# EAGLE schematic posidmux (EAGLE 6.6.0)

## Sheet 1 of 3
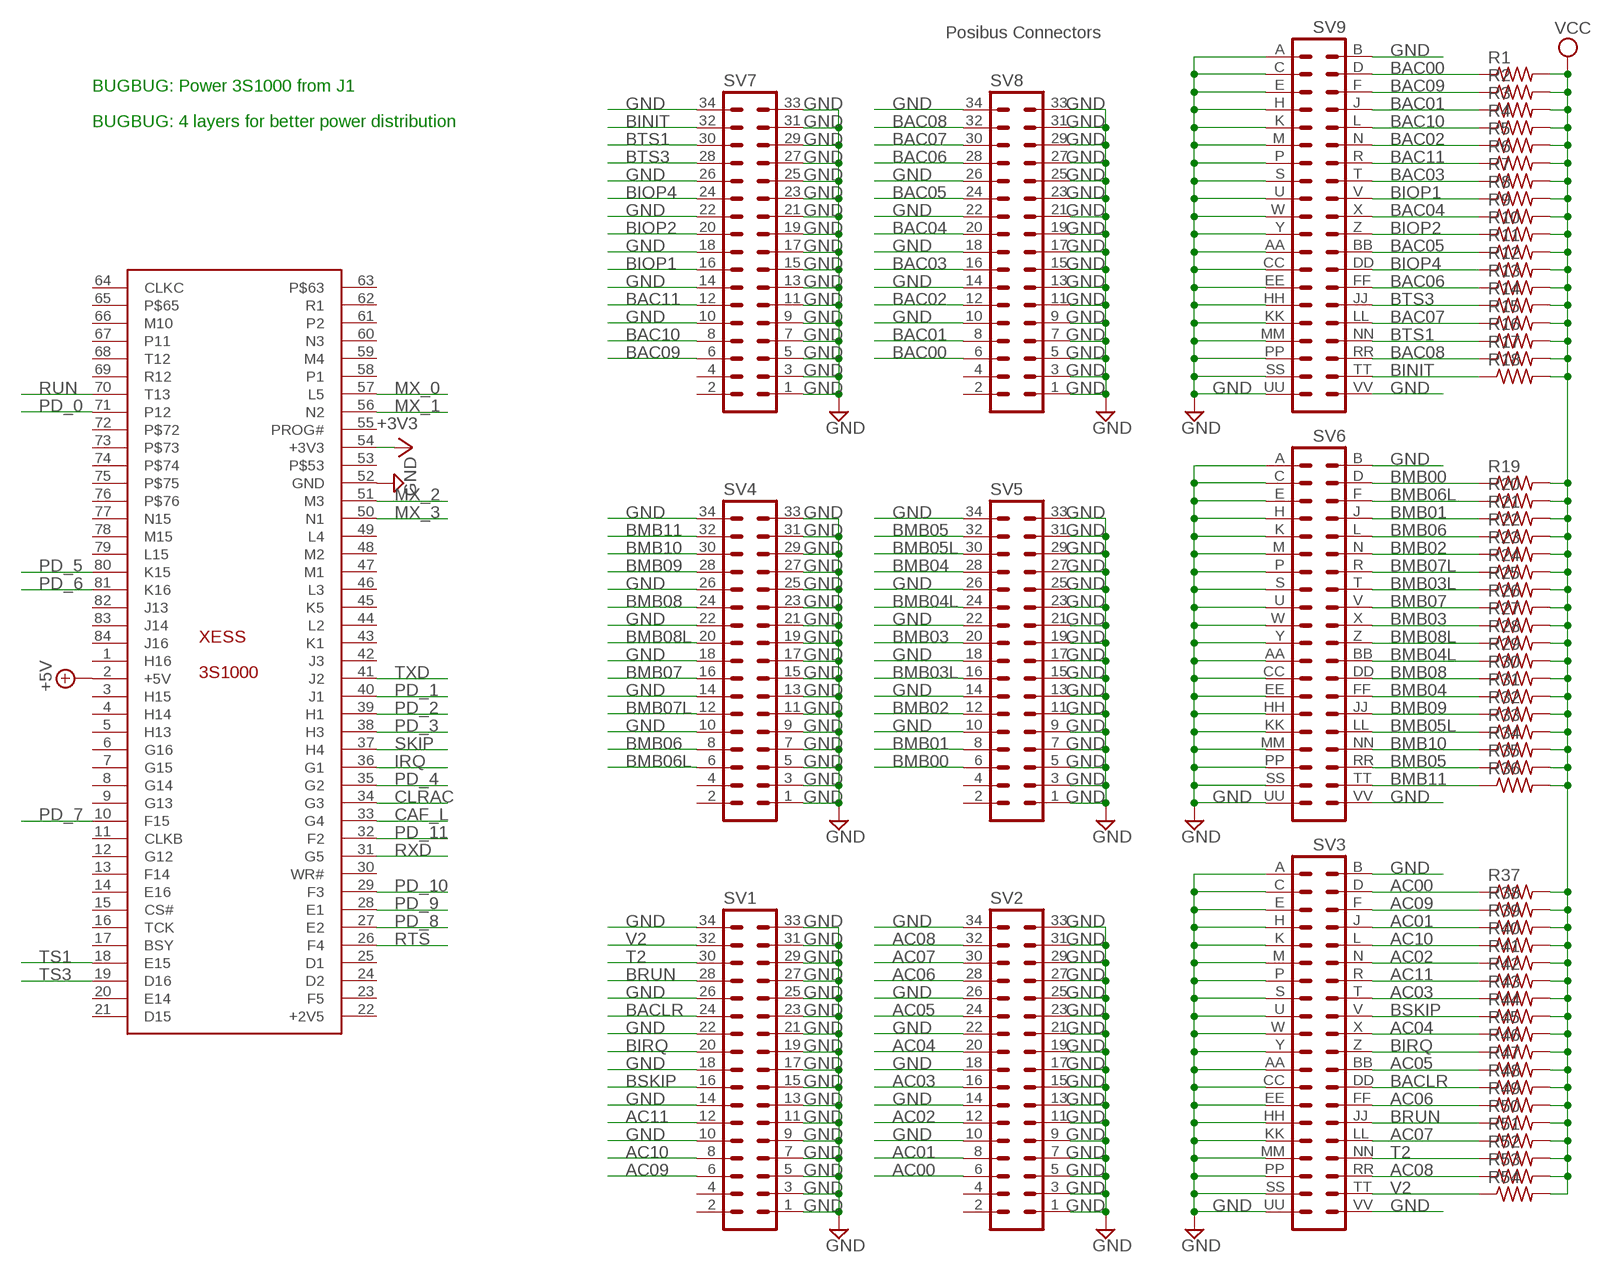
[diagram p0: schematic, sheet 1]

### Parts
R1  R-US_0207/10  [0207/10]
R2  R-US_0207/10  [0207/10]
R3  R-US_0207/10  [0207/10]
R4  R-US_0207/10  [0207/10]
R5  R-US_0207/10  [0207/10]
R6  R-US_0207/10  [0207/10]
R7  R-US_0207/10  [0207/10]
R8  R-US_0207/10  [0207/10]
R9  R-US_0207/10  [0207/10]
R10  R-US_0207/10  [0207/10]
R11  R-US_0207/10  [0207/10]
R12  R-US_0207/10  [0207/10]
R13  R-US_0207/10  [0207/10]
R14  R-US_0207/10  [0207/10]
R15  R-US_0207/10  [0207/10]
R16  R-US_0207/10  [0207/10]
R17  R-US_0207/10  [0207/10]
R18  R-US_0207/10  [0207/10]
R19  R-US_0207/10  [0207/10]
R20  R-US_0207/10  [0207/10]
R21  R-US_0207/10  [0207/10]
R22  R-US_0207/10  [0207/10]
R23  R-US_0207/10  [0207/10]
R24  R-US_0207/10  [0207/10]
R25  R-US_0207/10  [0207/10]
R26  R-US_0207/10  [0207/10]
R27  R-US_0207/10  [0207/10]
R28  R-US_0207/10  [0207/10]
R29  R-US_0207/10  [0207/10]
R30  R-US_0207/10  [0207/10]
R31  R-US_0207/10  [0207/10]
R32  R-US_0207/10  [0207/10]
R33  R-US_0207/10  [0207/10]
R34  R-US_0207/10  [0207/10]
R35  R-US_0207/10  [0207/10]
R36  R-US_0207/10  [0207/10]
R37  R-US_0207/10  [0207/10]
R38  R-US_0207/10  [0207/10]
R39  R-US_0207/10  [0207/10]
R40  R-US_0207/10  [0207/10]
R41  R-US_0207/10  [0207/10]
R42  R-US_0207/10  [0207/10]
R43  R-US_0207/10  [0207/10]
R44  R-US_0207/10  [0207/10]
R45  R-US_0207/10  [0207/10]
R46  R-US_0207/10  [0207/10]
R47  R-US_0207/10  [0207/10]
R48  R-US_0207/10  [0207/10]
R49  R-US_0207/10  [0207/10]
R50  R-US_0207/10  [0207/10]
R51  R-US_0207/10  [0207/10]
R52  R-US_0207/10  [0207/10]
R53  R-US_0207/10  [0207/10]
R54  R-US_0207/10  [0207/10]
SV1  MA17-2  [MA17-2]
SV2  MA17-2  [MA17-2]
SV3  DEC40PINV  [DEC40PINV]
SV4  MA17-2  [MA17-2]
SV5  MA17-2  [MA17-2]
SV6  DEC40PINV  [DEC40PINV]
SV7  MA17-2  [MA17-2]
SV8  MA17-2  [MA17-2]
SV9  DEC40PINV  [DEC40PINV]
XESS  3S1000  [3S1000]

### Nets
+3V3: XESS.54(+3V3) ; also sheet 3
+5V: XESS.2(+5V)
AC00: R37.1 SV2.6 SV3.D ; also sheet 3
AC01: R39.1 SV2.8 SV3.J ; also sheet 3
AC02: R41.1 SV2.12 SV3.N ; also sheet 3
AC03: R43.1 SV2.16 SV3.T ; also sheet 3
AC04: R45.1 SV2.20 SV3.X ; also sheet 3
AC05: R47.1 SV2.24 SV3.BB ; also sheet 3
AC06: R49.1 SV2.28 SV3.FF ; also sheet 3
AC07: R51.1 SV2.30 SV3.LL ; also sheet 3
AC08: R53.1 SV2.32 SV3.RR ; also sheet 3
AC09: R38.1 SV1.6 SV3.F ; also sheet 3
AC10: R40.1 SV1.8 SV3.L ; also sheet 3
AC11: R42.1 SV1.12 SV3.R ; also sheet 3
BAC00: R1.1 SV8.6 SV9.D ; also sheet 2
BAC01: R3.1 SV8.8 SV9.J ; also sheet 2
BAC02: R5.1 SV8.12 SV9.N ; also sheet 2
BAC03: R7.1 SV8.16 SV9.T ; also sheet 2
BAC04: R9.1 SV8.20 SV9.X ; also sheet 2
BAC05: R11.1 SV8.24 SV9.BB ; also sheet 2
BAC06: R13.1 SV8.28 SV9.FF ; also sheet 2
BAC07: R15.1 SV8.30 SV9.LL ; also sheet 2
BAC08: R17.1 SV8.32 SV9.RR ; also sheet 2
BAC09: R2.1 SV7.6 SV9.F ; also sheet 2
BAC10: R4.1 SV7.8 SV9.L ; also sheet 2
BAC11: R6.1 SV7.12 SV9.R ; also sheet 2
BACLR: R48.1 SV1.24 SV3.DD ; also sheet 3
BINIT: R18.1 SV7.32 SV9.TT ; also sheet 3
BIOP1: R8.1 SV7.16 SV9.V ; also sheet 3
BIOP2: R10.1 SV7.20 SV9.Z ; also sheet 3
BIOP4: R12.1 SV7.24 SV9.DD ; also sheet 3
BIRQ: R46.1 SV1.20 SV3.Z ; also sheet 3
BMB00: R19.1 SV5.6 SV6.D ; also sheet 2
BMB01: R21.1 SV5.8 SV6.J ; also sheet 2
BMB02: R23.1 SV5.12 SV6.N ; also sheet 2
BMB03: R27.1 SV5.20 SV6.X ; also sheet 2
BMB03L: R25.1 SV5.16 SV6.T ; also sheet 2
BMB04: R31.1 SV5.28 SV6.FF ; also sheet 2
BMB04L: R29.1 SV5.24 SV6.BB ; also sheet 2
BMB05: R35.1 SV5.32 SV6.RR ; also sheet 2
BMB05L: R33.1 SV5.30 SV6.LL ; also sheet 2
BMB06: R22.1 SV4.8 SV6.L ; also sheet 2
BMB06L: R20.1 SV4.6 SV6.F ; also sheet 2
BMB07: R26.1 SV4.16 SV6.V ; also sheet 2
BMB07L: R24.1 SV4.12 SV6.R ; also sheet 2
BMB08: R30.1 SV4.24 SV6.DD ; also sheet 2
BMB08L: R28.1 SV4.20 SV6.Z ; also sheet 2
BMB09: R32.1 SV4.28 SV6.JJ ; also sheet 2
BMB10: R34.1 SV4.30 SV6.NN ; also sheet 2
BMB11: R36.1 SV4.32 SV6.TT ; also sheet 2
BRUN: R50.1 SV1.28 SV3.JJ ; also sheet 3
BSKIP: R44.1 SV1.16 SV3.V ; also sheet 3
BTS1: R16.1 SV7.30 SV9.NN ; also sheet 3
BTS3: R14.1 SV7.28 SV9.JJ ; also sheet 3
CAF_L: XESS.33(G4) ; also sheet 3
CLRAC: XESS.34(G3) ; also sheet 3
GND: SV1.1 SV1.3 SV1.5 SV1.7 SV1.9 SV1.10 SV1.11 SV1.13 SV1.14 SV1.15 SV1.17 SV1.18 SV1.19 SV1.21 SV1.22 SV1.23 SV1.25 SV1.26 SV1.27 SV1.29 SV1.31 SV1.33 SV1.34 SV2.1 SV2.3 SV2.5 SV2.7 SV2.9 SV2.10 SV2.11 SV2.13 SV2.14 SV2.15 SV2.17 SV2.18 SV2.19 SV2.21 SV2.22 SV2.23 SV2.25 SV2.26 SV2.27 SV2.29 SV2.31 SV2.33 SV2.34 SV3.A SV3.AA SV3.B SV3.C SV3.CC SV3.E SV3.EE SV3.H SV3.HH SV3.K SV3.KK SV3.M SV3.MM SV3.P SV3.PP SV3.S SV3.SS SV3.U SV3.UU SV3.VV SV3.W SV3.Y SV4.1 SV4.3 SV4.5 SV4.7 SV4.9 SV4.10 SV4.11 SV4.13 SV4.14 SV4.15 SV4.17 SV4.18 SV4.19 SV4.21 SV4.22 SV4.23 SV4.25 SV4.26 SV4.27 SV4.29 SV4.31 SV4.33 SV4.34 SV5.1 SV5.3 SV5.5 SV5.7 SV5.9 SV5.10 SV5.11 SV5.13 SV5.14 SV5.15 SV5.17 SV5.18 SV5.19 SV5.21 SV5.22 SV5.23 SV5.25 SV5.26 SV5.27 SV5.29 SV5.31 SV5.33 SV5.34 SV6.A SV6.AA SV6.B SV6.C SV6.CC SV6.E SV6.EE SV6.H SV6.HH SV6.K SV6.KK SV6.M SV6.MM SV6.P SV6.PP SV6.S SV6.SS SV6.U SV6.UU SV6.VV SV6.W SV6.Y SV7.1 SV7.3 SV7.5 SV7.7 SV7.9 SV7.10 SV7.11 SV7.13 SV7.14 SV7.15 SV7.17 SV7.18 SV7.19 SV7.21 SV7.22 SV7.23 SV7.25 SV7.26 SV7.27 SV7.29 SV7.31 SV7.33 SV7.34 SV8.1 SV8.3 SV8.5 SV8.7 SV8.9 SV8.10 SV8.11 SV8.13 SV8.14 SV8.15 SV8.17 SV8.18 SV8.19 SV8.21 SV8.22 SV8.23 SV8.25 SV8.26 SV8.27 SV8.29 SV8.31 SV8.33 SV8.34 SV9.A SV9.AA SV9.B SV9.C SV9.CC SV9.E SV9.EE SV9.H SV9.HH SV9.K SV9.KK SV9.M SV9.MM SV9.P SV9.PP SV9.S SV9.SS SV9.U SV9.UU SV9.VV SV9.W SV9.Y XESS.52(GND) ; also sheet 2,3
IRQ: XESS.36(G1) ; also sheet 3
MX_0: XESS.57(L5) ; also sheet 2
MX_1: XESS.56(N2) ; also sheet 2
MX_2: XESS.51(M3) ; also sheet 2
MX_3: XESS.50(N1) ; also sheet 2
PD_0: XESS.71(P12) ; also sheet 2,3
PD_1: XESS.40(J1) ; also sheet 2,3
PD_2: XESS.39(H1) ; also sheet 2,3
PD_3: XESS.38(H3) ; also sheet 2,3
PD_4: XESS.35(G2) ; also sheet 2,3
PD_5: XESS.80(K15) ; also sheet 2,3
PD_6: XESS.81(K16) ; also sheet 2,3
PD_7: XESS.10(F15) ; also sheet 2,3
PD_8: XESS.27(E2) ; also sheet 2,3
PD_9: XESS.28(E1) ; also sheet 2,3
PD_10: XESS.29(F3) ; also sheet 2,3
PD_11: XESS.32(F2) ; also sheet 2,3
RTS: XESS.26(F4) ; also sheet 3
RUN: XESS.70(T13) ; also sheet 3
RXD: XESS.31(G5) ; also sheet 3
SKIP: XESS.37(H4) ; also sheet 3
T2: R52.1 SV1.30 SV3.NN
TS1: XESS.18(E15) ; also sheet 3
TS3: XESS.19(D16) ; also sheet 3
TXD: XESS.41(J2) ; also sheet 3
V2: R54.1 SV1.32 SV3.TT
VCC: R1.2 R2.2 R3.2 R4.2 R5.2 R6.2 R7.2 R8.2 R9.2 R10.2 R11.2 R12.2 R13.2 R14.2 R15.2 R16.2 R17.2 R18.2 R19.2 R20.2 R21.2 R22.2 R23.2 R24.2 R25.2 R26.2 R27.2 R28.2 R29.2 R30.2 R31.2 R32.2 R33.2 R34.2 R35.2 R36.2 R37.2 R38.2 R39.2 R40.2 R41.2 R42.2 R43.2 R44.2 R45.2 R46.2 R47.2 R48.2 R49.2 R50.2 R51.2 R52.2 R53.2 R54.2 ; also sheet 2,3
Unconnected: SV1.2 SV1.4 SV2.2 SV2.4 SV4.2 SV4.4 SV5.2 SV5.4 SV7.2 SV7.4 SV8.2 SV8.4 XESS.1(H16) XESS.3(H15) XESS.4(H14) XESS.5(H13) XESS.6(G16) XESS.7(G15) XESS.8(G14) XESS.9(G13) XESS.11(CLKB) XESS.12(G12) XESS.13(F14) XESS.14(E16) XESS.15(CS#) XESS.16(TCK) XESS.17(BSY) XESS.20(E14) XESS.21(D15) XESS.23(F5) XESS.24(D2) XESS.25(D1) XESS.30(WR#) XESS.42(J3) XESS.43(K1) XESS.44(L2) XESS.45(K5) XESS.46(L3) XESS.47(M1) XESS.48(M2) XESS.49(L4) XESS.53 XESS.55(PROG#) XESS.58(P1) XESS.59(M4) XESS.60(N3) XESS.61(P2) XESS.62(R1) XESS.63 XESS.64(CLKC) XESS.65 XESS.66(M10) XESS.67(P11) XESS.68(T12) XESS.69(R12) XESS.72 XESS.73 XESS.74 XESS.75 XESS.76 XESS.77(N15) XESS.78(M15) XESS.79(L15) XESS.82(J13) XESS.83(J14) XESS.84(J16)

### Notes on the sheet
- Posibus Connectors
- BUGBUG: Power 3S1000 from J1
- BUGBUG: 4 layers for better power distribution

## Sheet 2 of 3
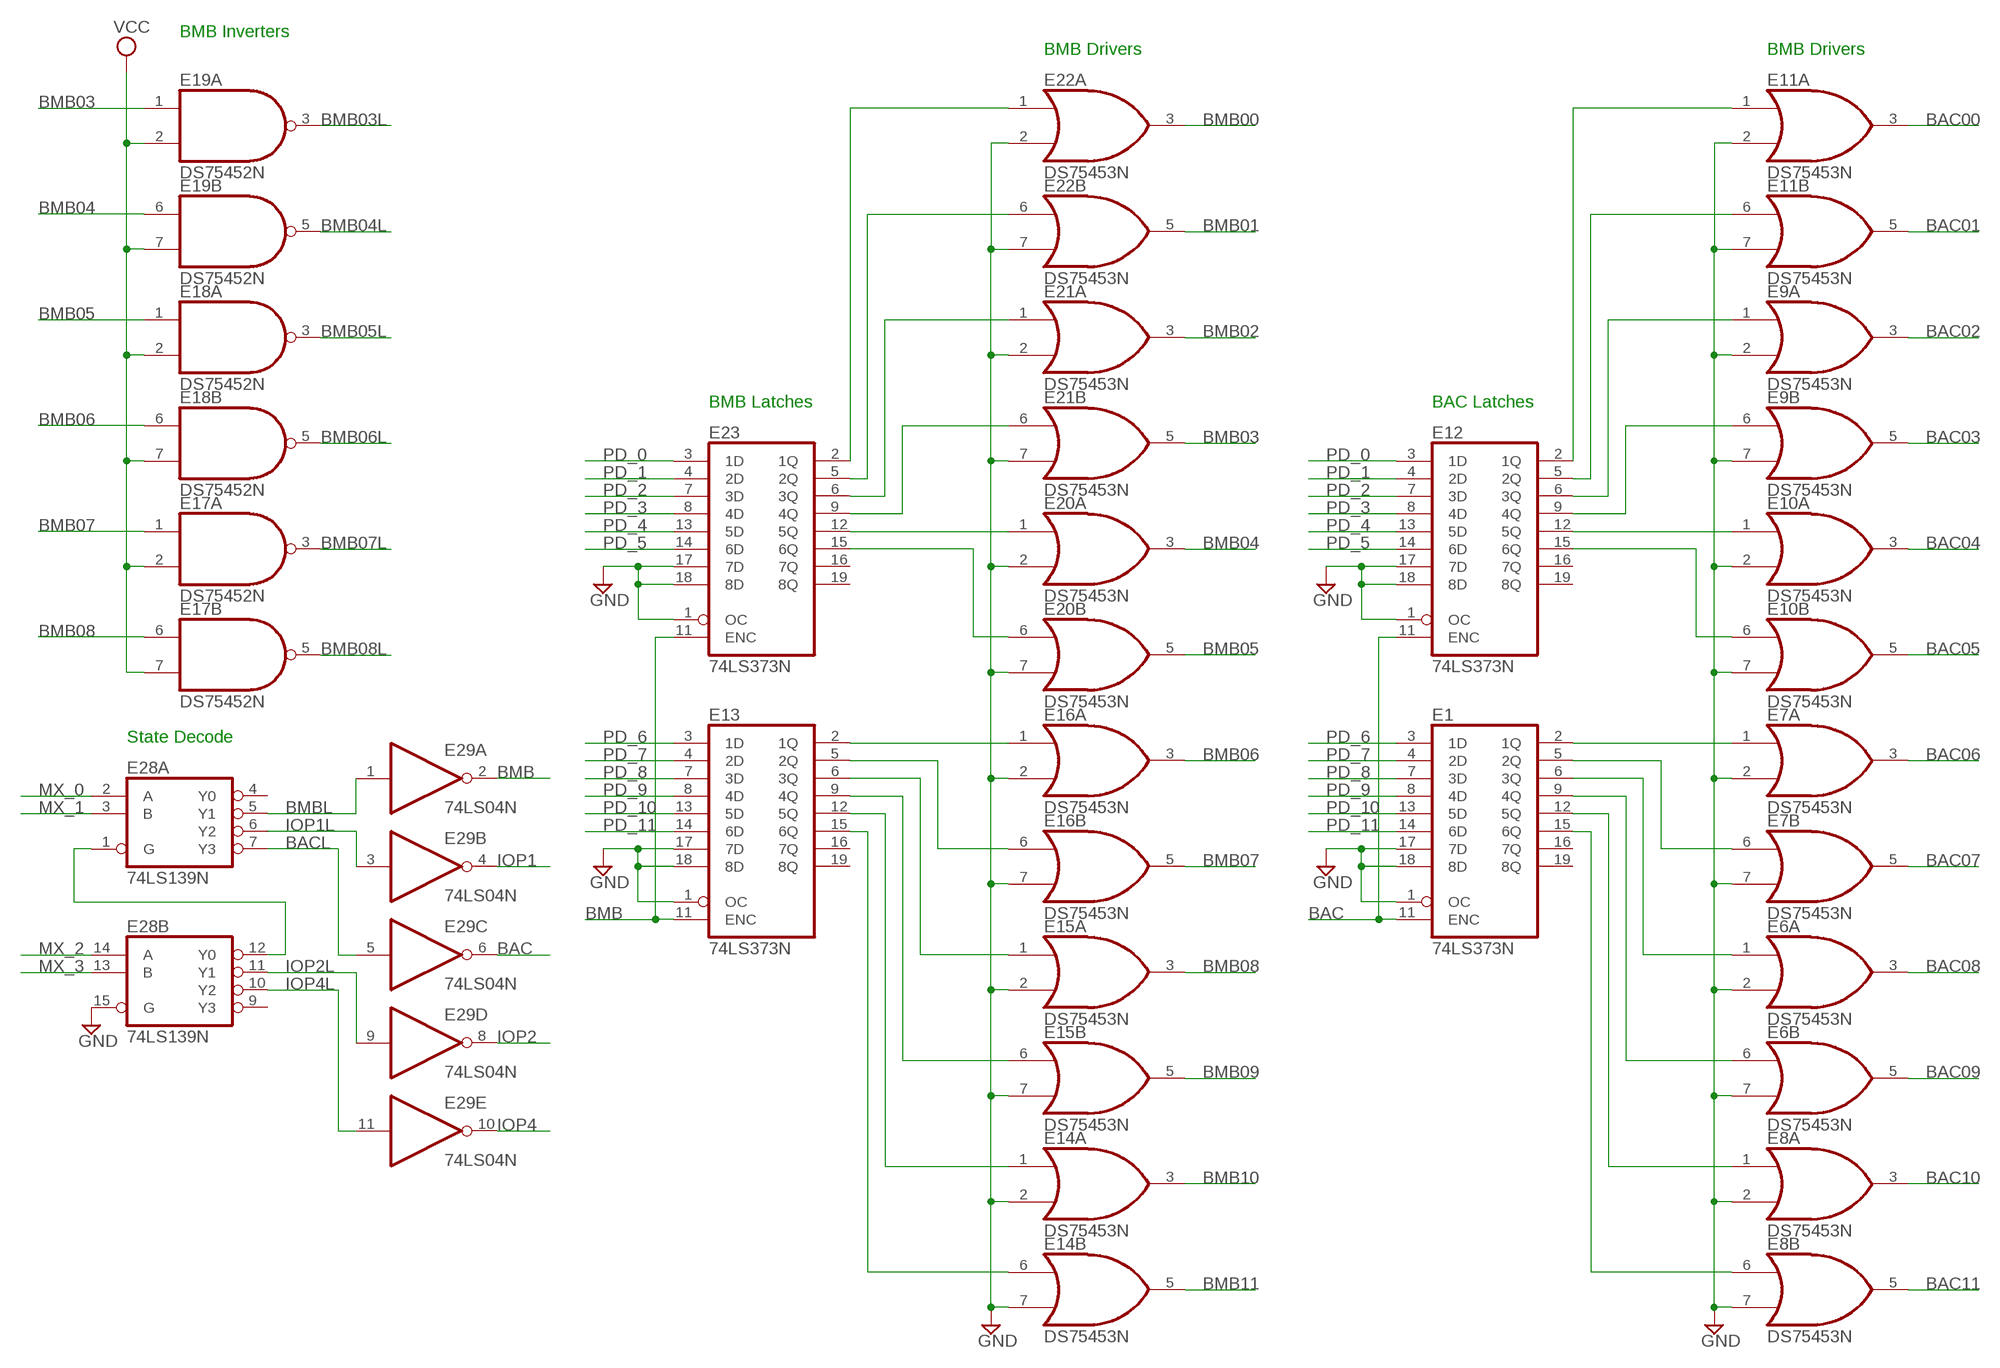
[diagram p1: schematic, sheet 2]

### Parts
E1  74LS373N  [DIL20]
E6  DS75453N  [DIL08]
E7  DS75453N  [DIL08]
E8  DS75453N  [DIL08]
E9  DS75453N  [DIL08]
E10  DS75453N  [DIL08]
E11  DS75453N  [DIL08]
E12  74LS373N  [DIL20]
E13  74LS373N  [DIL20]
E14  DS75453N  [DIL08]
E15  DS75453N  [DIL08]
E16  DS75453N  [DIL08]
E17  DS75452N  [DIL08]
E18  DS75452N  [DIL08]
E19  DS75452N  [DIL08]
E20  DS75453N  [DIL08]
E21  DS75453N  [DIL08]
E22  DS75453N  [DIL08]
E23  74LS373N  [DIL20]
E28  74LS139N  [DIL16]
E29  74LS04N  [DIL14]

### Nets
BAC: E1.11(ENC) E12.11(ENC) E29.6(C:O)
BAC00: E11.3(A:O) ; also sheet 1
BAC01: E11.5(B:O) ; also sheet 1
BAC02: E9.3(A:O) ; also sheet 1
BAC03: E9.5(B:O) ; also sheet 1
BAC04: E10.3(A:O) ; also sheet 1
BAC05: E10.5(B:O) ; also sheet 1
BAC06: E7.3(A:O) ; also sheet 1
BAC07: E7.5(B:O) ; also sheet 1
BAC08: E6.3(A:O) ; also sheet 1
BAC09: E6.5(B:O) ; also sheet 1
BAC10: E8.3(A:O) ; also sheet 1
BAC11: E8.5(B:O) ; also sheet 1
BACL: E28.7(A:Y3) E29.5(C:I)
BMB: E13.11(ENC) E23.11(ENC) E29.2(A:O)
BMB00: E22.3(A:O) ; also sheet 1
BMB01: E22.5(B:O) ; also sheet 1
BMB02: E21.3(A:O) ; also sheet 1
BMB03: E19.1(A:I0) E21.5(B:O) ; also sheet 1
BMB03L: E19.3(A:O) ; also sheet 1
BMB04: E19.6(B:I0) E20.3(A:O) ; also sheet 1
BMB04L: E19.5(B:O) ; also sheet 1
BMB05: E18.1(A:I0) E20.5(B:O) ; also sheet 1
BMB05L: E18.3(A:O) ; also sheet 1
BMB06: E16.3(A:O) E18.6(B:I0) ; also sheet 1
BMB06L: E18.5(B:O) ; also sheet 1
BMB07: E16.5(B:O) E17.1(A:I0) ; also sheet 1
BMB07L: E17.3(A:O) ; also sheet 1
BMB08: E15.3(A:O) E17.6(B:I0) ; also sheet 1
BMB08L: E17.5(B:O) ; also sheet 1
BMB09: E15.5(B:O) ; also sheet 1
BMB10: E14.3(A:O) ; also sheet 1
BMB11: E14.5(B:O) ; also sheet 1
BMBL: E28.5(A:Y1) E29.1(A:I)
GND: E1.1(OC) E1.17(7D) E1.18(8D) E6.2(A:I1) E6.7(B:I1) E7.2(A:I1) E7.7(B:I1) E8.2(A:I1) E8.7(B:I1) E9.2(A:I1) E9.7(B:I1) E10.2(A:I1) E10.7(B:I1) E11.2(A:I1) E11.7(B:I1) E12.1(OC) E12.17(7D) E12.18(8D) E13.1(OC) E13.17(7D) E13.18(8D) E14.2(A:I1) E14.7(B:I1) E15.2(A:I1) E15.7(B:I1) E16.2(A:I1) E16.7(B:I1) E20.2(A:I1) E20.7(B:I1) E21.2(A:I1) E21.7(B:I1) E22.2(A:I1) E22.7(B:I1) E23.1(OC) E23.17(7D) E23.18(8D) E28.15(B:G) ; also sheet 1,3
IOP1: E29.4(B:O) ; also sheet 3
IOP1L: E28.6(A:Y2) E29.3(B:I) ; also sheet 3
IOP2: E29.8(D:O) ; also sheet 3
IOP2L: E28.11(B:Y1) E29.9(D:I) ; also sheet 3
IOP4: E29.10(E:O) ; also sheet 3
IOP4L: E28.10(B:Y2) E29.11(E:I) ; also sheet 3
MX_0: E28.2(A:A) ; also sheet 1
MX_00XX: E28.1(A:G) E28.12(B:Y0)
MX_1: E28.3(A:B) ; also sheet 1
MX_2: E28.14(B:A) ; also sheet 1
MX_3: E28.13(B:B) ; also sheet 1
N$1: E22.1(A:I0) E23.2(1Q)
N$2: E22.6(B:I0) E23.5(2Q)
N$3: E21.1(A:I0) E23.6(3Q)
N$4: E21.6(B:I0) E23.9(4Q)
N$5: E20.1(A:I0) E23.12(5Q)
N$6: E13.15(6Q) E14.6(B:I0)
N$7: E13.12(5Q) E14.1(A:I0)
N$8: E13.9(4Q) E15.6(B:I0)
N$9: E13.6(3Q) E15.1(A:I0)
N$10: E13.5(2Q) E16.6(B:I0)
N$11: E13.2(1Q) E16.1(A:I0)
N$12: E20.6(B:I0) E23.15(6Q)
N$13: E11.1(A:I0) E12.2(1Q)
N$14: E11.6(B:I0) E12.5(2Q)
N$21: E9.1(A:I0) E12.6(3Q)
N$22: E9.6(B:I0) E12.9(4Q)
N$23: E10.1(A:I0) E12.12(5Q)
N$24: E1.15(6Q) E8.6(B:I0)
N$25: E1.12(5Q) E8.1(A:I0)
N$26: E1.9(4Q) E6.6(B:I0)
N$27: E1.6(3Q) E6.1(A:I0)
N$28: E1.5(2Q) E7.6(B:I0)
N$29: E10.6(B:I0) E12.15(6Q)
N$30: E1.2(1Q) E7.1(A:I0)
PD_0: E12.3(1D) E23.3(1D) ; also sheet 1,3
PD_1: E12.4(2D) E23.4(2D) ; also sheet 1,3
PD_2: E12.7(3D) E23.7(3D) ; also sheet 1,3
PD_3: E12.8(4D) E23.8(4D) ; also sheet 1,3
PD_4: E12.13(5D) E23.13(5D) ; also sheet 1,3
PD_5: E12.14(6D) E23.14(6D) ; also sheet 1,3
PD_6: E1.3(1D) E13.3(1D) ; also sheet 1,3
PD_7: E1.4(2D) E13.4(2D) ; also sheet 1,3
PD_8: E1.7(3D) E13.7(3D) ; also sheet 1,3
PD_9: E1.8(4D) E13.8(4D) ; also sheet 1,3
PD_10: E1.13(5D) E13.13(5D) ; also sheet 1,3
PD_11: E1.14(6D) E13.14(6D) ; also sheet 1,3
VCC: E17.2(A:I1) E17.7(B:I1) E18.2(A:I1) E18.7(B:I1) E19.2(A:I1) E19.7(B:I1) ; also sheet 1,3
Unconnected: E1.16(7Q) E1.19(8Q) E12.16(7Q) E12.19(8Q) E13.16(7Q) E13.19(8Q) E23.16(7Q) E23.19(8Q) E28.4(A:Y0) E28.9(B:Y3) E29.12(F:O) E29.13(F:I)

### Notes on the sheet
- BMB Inverters
- BMB Drivers | BMB Drivers
- BMB Latches | BAC Latches
- State Decode

## Sheet 3 of 3
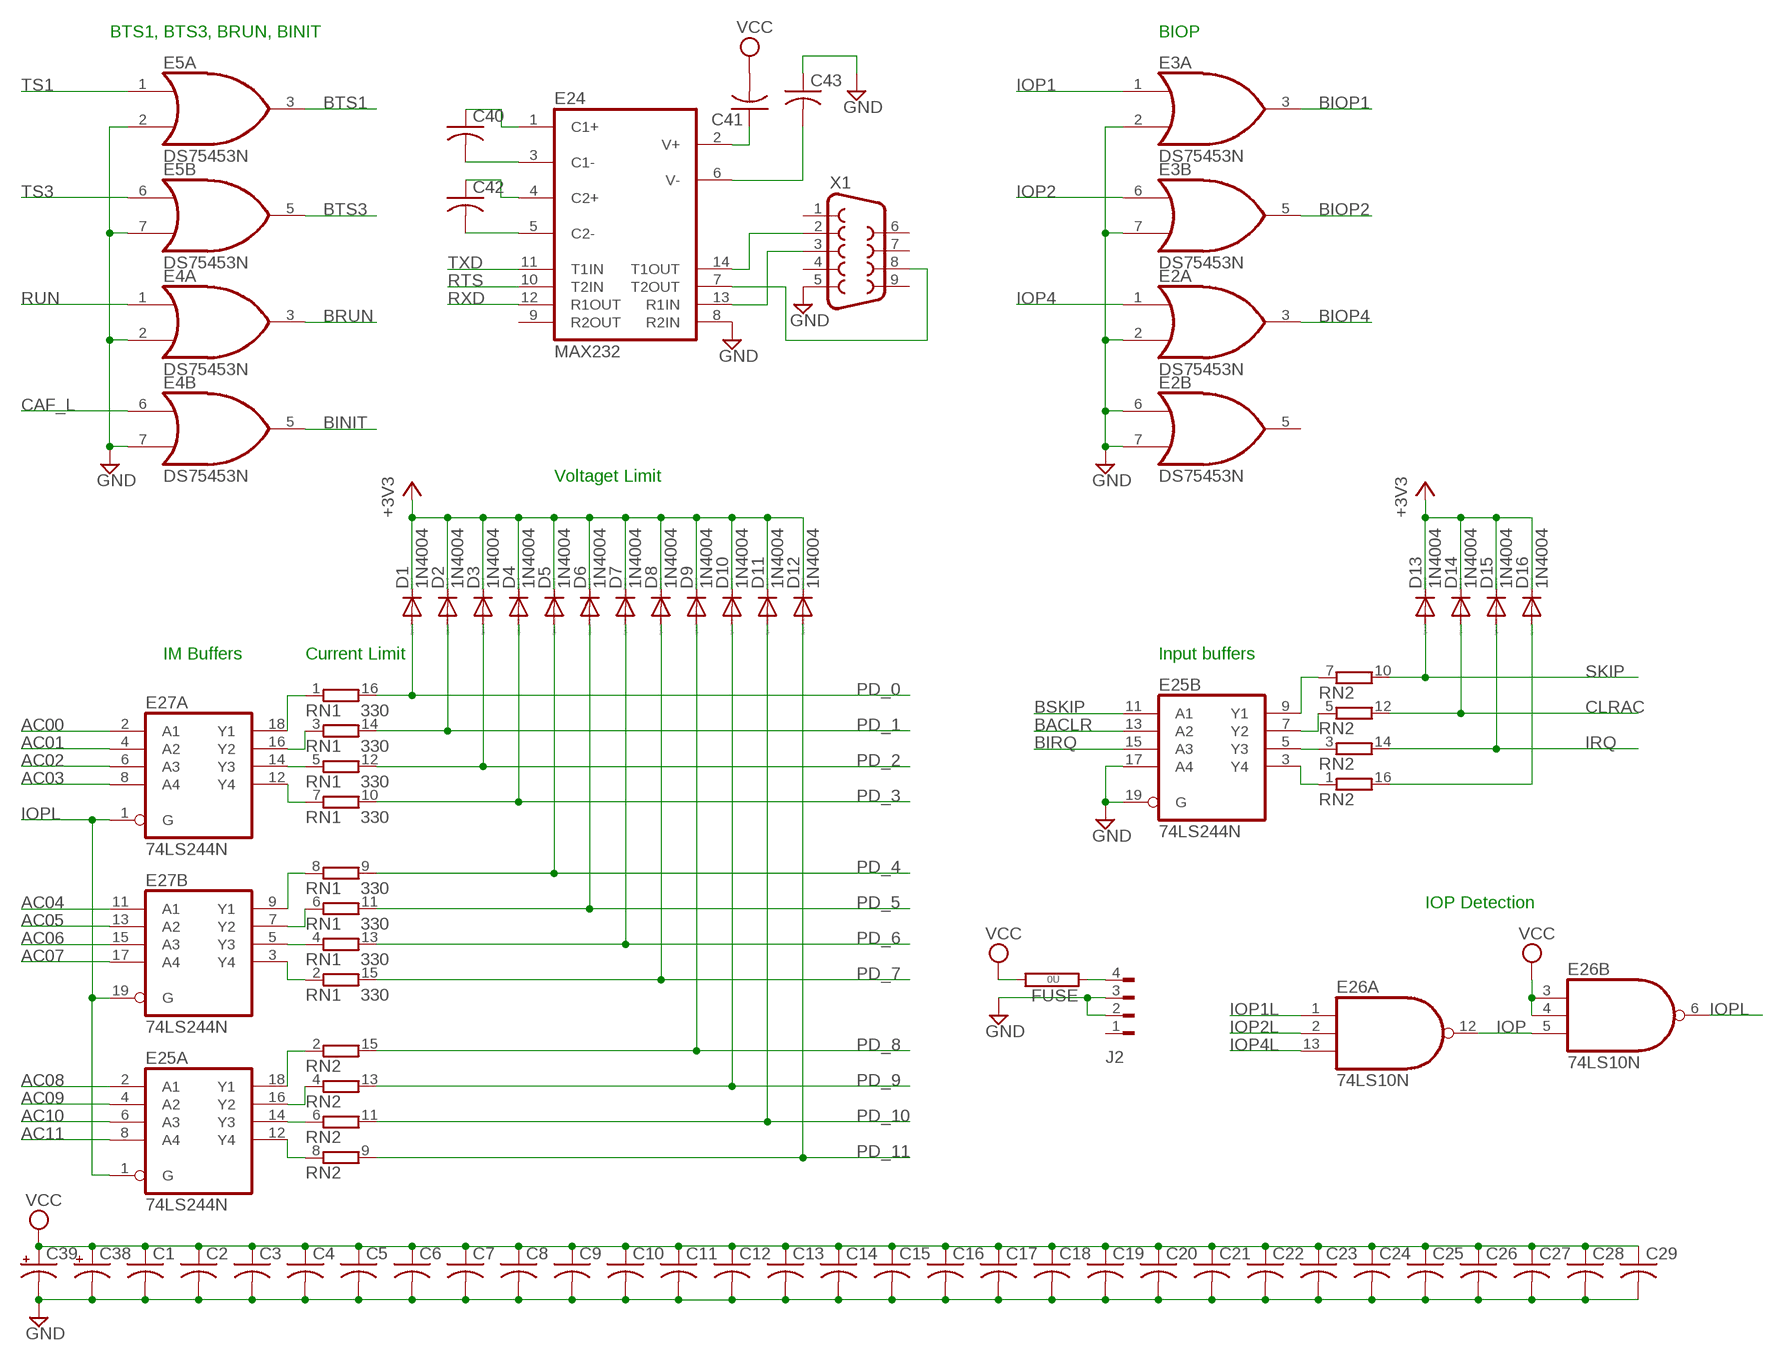
[diagram p2: schematic, sheet 3]

### Parts
C1  C-US050-025X075  [C050-025X075]
C2  C-US050-025X075  [C050-025X075]
C3  C-US050-025X075  [C050-025X075]
C4  C-US050-025X075  [C050-025X075]
C5  C-US050-025X075  [C050-025X075]
C6  C-US050-025X075  [C050-025X075]
C7  C-US050-025X075  [C050-025X075]
C8  C-US050-025X075  [C050-025X075]
C9  C-US050-025X075  [C050-025X075]
C10  C-US050-025X075  [C050-025X075]
C11  C-US050-025X075  [C050-025X075]
C12  C-US050-025X075  [C050-025X075]
C13  C-US050-025X075  [C050-025X075]
C14  C-US050-025X075  [C050-025X075]
C15  C-US050-025X075  [C050-025X075]
C16  C-US050-025X075  [C050-025X075]
C17  C-US050-025X075  [C050-025X075]
C18  C-US050-025X075  [C050-025X075]
C19  C-US050-025X075  [C050-025X075]
C20  C-US050-025X075  [C050-025X075]
C21  C-US050-025X075  [C050-025X075]
C22  C-US050-025X075  [C050-025X075]
C23  C-US050-025X075  [C050-025X075]
C24  C-US050-025X075  [C050-025X075]
C25  C-US050-025X075  [C050-025X075]
C26  C-US050-025X075  [C050-025X075]
C27  C-US050-025X075  [C050-025X075]
C28  C-US050-025X075  [C050-025X075]
C29  C-US050-025X075  [C050-025X075]
C38  CPOL-USE22-6AXIAL  [E22-6]
C39  CPOL-USE22-6AXIAL  [E22-6]
C40  C-US050-025X075  [C050-025X075]
C41  C-US050-025X075  [C050-025X075]
C42  C-US050-025X075  [C050-025X075]
C43  C-US050-025X075  [C050-025X075]
D1  1N4004  [DO41-10]
D2  1N4004  [DO41-10]
D3  1N4004  [DO41-10]
D4  1N4004  [DO41-10]
D5  1N4004  [DO41-10]
D6  1N4004  [DO41-10]
D7  1N4004  [DO41-10]
D8  1N4004  [DO41-10]
D9  1N4004  [DO41-10]
D10  1N4004  [DO41-10]
D11  1N4004  [DO41-10]
D12  1N4004  [DO41-10]
D13  1N4004  [DO41-10]
D14  1N4004  [DO41-10]
D15  1N4004  [DO41-10]
D16  1N4004  [DO41-10]
E2  DS75453N  [DIL08]
E3  DS75453N  [DIL08]
E4  DS75453N  [DIL08]
E5  DS75453N  [DIL08]
E24  MAX232  [DIL16]
E25  74LS244N  [DIL20]
E26  74LS10N  [DIL14]
E27  74LS244N  [DIL20]
FUSE  0R  [0R/10]
J2  FLOPPY-4  [FLOPPY-4]
RN1  330  8R-P  [DIL16]
RN2  8R-P  [DIL16]
X1  F09HP  [F09HP]

### Nets
+3V3: D1.C D2.C D3.C D4.C D5.C D6.C D7.C D8.C D9.C D10.C D11.C D12.C D13.C D14.C D15.C D16.C ; also sheet 1
AC00: E27.2(A:A1) ; also sheet 1
AC01: E27.4(A:A2) ; also sheet 1
AC02: E27.6(A:A3) ; also sheet 1
AC03: E27.8(A:A4) ; also sheet 1
AC04: E27.11(B:A1) ; also sheet 1
AC05: E27.13(B:A2) ; also sheet 1
AC06: E27.15(B:A3) ; also sheet 1
AC07: E27.17(B:A4) ; also sheet 1
AC08: E25.2(A:A1) ; also sheet 1
AC09: E25.4(A:A2) ; also sheet 1
AC10: E25.6(A:A3) ; also sheet 1
AC11: E25.8(A:A4) ; also sheet 1
BACLR: E25.13(B:A2) ; also sheet 1
BINIT: E4.5(B:O) ; also sheet 1
BIOP1: E3.3(A:O) ; also sheet 1
BIOP2: E3.5(B:O) ; also sheet 1
BIOP4: E2.3(A:O) ; also sheet 1
BIRQ: E25.15(B:A3) ; also sheet 1
BRUN: E4.3(A:O) ; also sheet 1
BSKIP: E25.11(B:A1) ; also sheet 1
BTS1: E5.3(A:O) ; also sheet 1
BTS3: E5.5(B:O) ; also sheet 1
CAF_L: E4.6(B:I0) ; also sheet 1
CLRAC: D14.A RN2.12 ; also sheet 1
GND: C1.2 C2.2 C3.2 C4.2 C5.2 C6.2 C7.2 C8.2 C9.2 C10.2 C11.2 C12.2 C13.2 C14.2 C15.2 C16.2 C17.2 C18.2 C19.2 C20.2 C21.2 C22.2 C23.2 C24.2 C25.2 C26.2 C27.2 C28.2 C29.2 C38.- C39.- C43.1 E2.2(A:I1) E2.6(B:I0) E2.7(B:I1) E3.2(A:I1) E3.7(B:I1) E4.2(A:I1) E4.7(B:I1) E5.2(A:I1) E5.7(B:I1) E24.8(R2IN) E25.17(B:A4) E25.19(B:G) J2.2 J2.3 X1.5 ; also sheet 1,2
IOP: E26.5(B:I2) E26.12(A:O)
IOP1: E3.1(A:I0) ; also sheet 2
IOP1L: E26.1(A:I0) ; also sheet 2
IOP2: E3.6(B:I0) ; also sheet 2
IOP2L: E26.2(A:I1) ; also sheet 2
IOP4: E2.1(A:I0) ; also sheet 2
IOP4L: E26.13(A:I2) ; also sheet 2
IOPL: E25.1(A:G) E26.6(B:O) E27.1(A:G) E27.19(B:G)
IRQ: D15.A RN2.14 ; also sheet 1
N$15: E27.18(A:Y1) RN1.1
N$16: E27.16(A:Y2) RN1.3
N$17: E27.14(A:Y3) RN1.5
N$18: E27.12(A:Y4) RN1.7
N$19: E27.9(B:Y1) RN1.8
N$20: E27.7(B:Y2) RN1.6
N$31: E27.5(B:Y3) RN1.4
N$32: E27.3(B:Y4) RN1.2
N$33: E25.16(A:Y2) RN2.4
N$34: E25.18(A:Y1) RN2.2
N$35: E25.14(A:Y3) RN2.6
N$36: E25.12(A:Y4) RN2.8
N$37: E25.9(B:Y1) RN2.7
N$38: E25.7(B:Y2) RN2.5
N$39: E25.5(B:Y3) RN2.3
N$40: E25.3(B:Y4) RN2.1
N$41 [Supply]: FUSE.1 J2.4
N$42: D16.A RN2.16
N$43: E24.14(T1OUT) X1.2
N$44: E24.7(T2OUT) X1.8
N$45: E24.13(R1IN) X1.3
N$46: C42.2 E24.5(C2-)
N$47: C42.1 E24.4(C2+)
N$48: C40.2 E24.3(C1-)
N$49: C40.1 E24.1(C1+)
N$50: C41.1 E24.2(V+)
N$51: C43.2 E24.6(V-)
PD_0: D1.A RN1.16 ; also sheet 1,2
PD_1: D2.A RN1.14 ; also sheet 1,2
PD_2: D3.A RN1.12 ; also sheet 1,2
PD_3: D4.A RN1.10 ; also sheet 1,2
PD_4: D5.A RN1.9 ; also sheet 1,2
PD_5: D6.A RN1.11 ; also sheet 1,2
PD_6: D7.A RN1.13 ; also sheet 1,2
PD_7: D8.A RN1.15 ; also sheet 1,2
PD_8: D9.A RN2.15 ; also sheet 1,2
PD_9: D10.A RN2.13 ; also sheet 1,2
PD_10: D11.A RN2.11 ; also sheet 1,2
PD_11: D12.A RN2.9 ; also sheet 1,2
RTS: E24.10(T2IN) ; also sheet 1
RUN: E4.1(A:I0) ; also sheet 1
RXD: E24.12(R1OUT) ; also sheet 1
SKIP: D13.A RN2.10 ; also sheet 1
TS1: E5.1(A:I0) ; also sheet 1
TS3: E5.6(B:I0) ; also sheet 1
TXD: E24.11(T1IN) ; also sheet 1
VCC: C1.1 C2.1 C3.1 C4.1 C5.1 C6.1 C7.1 C8.1 C9.1 C10.1 C11.1 C12.1 C13.1 C14.1 C15.1 C16.1 C17.1 C18.1 C19.1 C20.1 C21.1 C22.1 C23.1 C24.1 C25.1 C26.1 C27.1 C28.1 C29.1 C38.+ C39.+ C41.2 E26.3(B:I0) E26.4(B:I1) FUSE.2 ; also sheet 1,2
Unconnected: E2.5(B:O) E24.9(R2OUT) E26.8(C:O) E26.9(C:I0) E26.10(C:I1) E26.11(C:I2) J2.1 X1.1 X1.4 X1.6 X1.7 X1.9

### Notes on the sheet
- BTS1, BTS3, BRUN, BINIT | BIOP
- Voltaget Limit
- IM Buffers | Current Limit | Input buffers
- IOP Detection

## Power pins joined to a net without a drawn wire
+2V5: XESS.22(+2V5)
GND: E1.10(GND) E2.4(P:GND) E3.4(P:GND) E4.4(P:GND) E5.4(P:GND) E6.4(P:GND) E7.4(P:GND) E8.4(P:GND) E9.4(P:GND) E10.4(P:GND) E11.4(P:GND) E12.10(GND) E13.10(GND) E14.4(P:GND) E15.4(P:GND) E16.4(P:GND) E17.4(P:GND) E18.4(P:GND) E19.4(P:GND) E20.4(P:GND) E21.4(P:GND) E22.4(P:GND) E23.10(GND) E24.15(GND) E25.10(P:GND) E26.7(P:GND) E27.10(P:GND) E28.8(P:GND) E29.7(P:GND)
VCC: E1.20(VCC) E2.8(P:VCC) E3.8(P:VCC) E4.8(P:VCC) E5.8(P:VCC) E6.8(P:VCC) E7.8(P:VCC) E8.8(P:VCC) E9.8(P:VCC) E10.8(P:VCC) E11.8(P:VCC) E12.20(VCC) E13.20(VCC) E14.8(P:VCC) E15.8(P:VCC) E16.8(P:VCC) E17.8(P:VCC) E18.8(P:VCC) E19.8(P:VCC) E20.8(P:VCC) E21.8(P:VCC) E22.8(P:VCC) E23.20(VCC) E24.16(VCC) E25.20(P:VCC) E26.14(P:VCC) E27.20(P:VCC) E28.16(P:VCC) E29.14(P:VCC)

## Library data of the parts
C1-C29 C40-C43 = rcl:C-US: CAPACITOR, American symbol
C38 C39 = rcl:CPOL-US: POLARIZED CAPACITOR, American symbol
D1-D16 = diode:1N4004: DIODE general purpose rectifier, 1 A
E1 E12 E13 E23 = 74xx-us:74*373: Octal D type transparent LATCH, edge triggered
E2-E11 E14-E16 E20-E22 = dec-con:DS75453: Quad 2-input OR gate, open collector output
E17-E19 = dec-con:DS75452: Quad 2-input NAND gate, open collector output
E24 = maxim:MAX232: RS232 TRANSCEIVER; MF: MAXIM; MPN: MAX232ACPE+; OC_FARNELL: 9723773; OC_NEWARK: 68K4544
E25 E27 = 74xx-us:74*244: Octal BUFFER and LINE DRIVER, 3-state
E26 = 74xx-us:74*10: Triple 3-input NAND gate
E28 = 74xx-us:74*139: Dual 2-line to 4-line DECODER/DEMULTIPLEXER
E29 = 74xx-us:74*04: Hex INVERTER
FUSE = jumper:0R: Bridge 0R 10mm
J2 = con-amp:FLOPPY-4: MATE N-LOCK Floppy / HDD conector Distributor: Bürklin 71F970
R1-R54 = rcl:R-US_: RESISTOR, American symbol
RN1 RN2 = resistor-dil:8R-P: DIL RESISTOR; OC_FARNELL: unknown; OC_NEWARK: unknown
SV1 SV2 SV4 SV5 SV7 SV8 = con-lstb:MA17-2: PIN HEADER; OC_FARNELL: unknown; OC_NEWARK: unknown
SV3 SV6 SV9 = dec-con:DEC40PIN: PIN HEADER
X1 = con-subd:F09: SUB-D; OC_FARNELL: unknown; OC_NEWARK: unknown
XESS = xess:3S1000

## Net classes
1 Supply: width 1.905 mm, clearance 0.508 mm